# EAGLE design breakout (EAGLE 8.1.1)
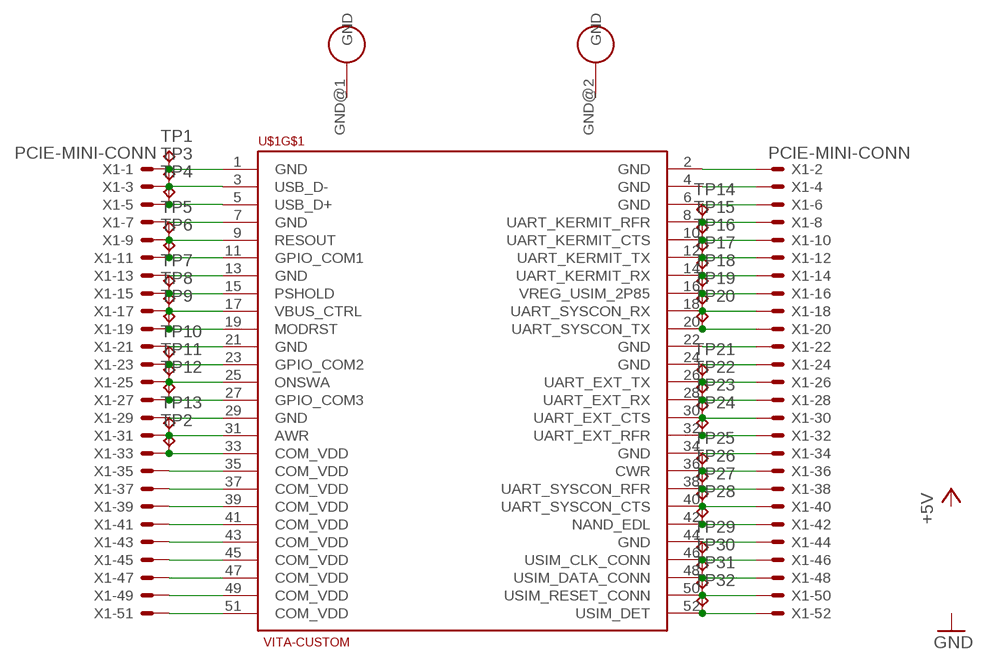
[diagram p0: schematic, sheet 1]

## Parts
TP1  TPTP20R  [TP20R]
TP2  TPTP20R  [TP20R]
TP3  TPTP20R  [TP20R]
TP4  TPTP20R  [TP20R]
TP5  TPTP20R  [TP20R]
TP6  TPTP20R  [TP20R]
TP7  TPTP20R  [TP20R]
TP8  TPTP20R  [TP20R]
TP9  TPTP20R  [TP20R]
TP10  TPTP20R  [TP20R]
TP11  TPTP20R  [TP20R]
TP12  TPTP20R  [TP20R]
TP13  TPTP20R  [TP20R]
TP14  TPTP20R  [TP20R]
TP15  TPTP20R  [TP20R]
TP16  TPTP20R  [TP20R]
TP17  TPTP20R  [TP20R]
TP18  TPTP20R  [TP20R]
TP19  TPTP20R  [TP20R]
TP20  TPTP20R  [TP20R]
TP21  TPTP20R  [TP20R]
TP22  TPTP20R  [TP20R]
TP23  TPTP20R  [TP20R]
TP24  TPTP20R  [TP20R]
TP25  TPTP20R  [TP20R]
TP26  TPTP20R  [TP20R]
TP27  TPTP20R  [TP20R]
TP28  TPTP20R  [TP20R]
TP29  TPTP20R  [TP20R]
TP30  TPTP20R  [TP20R]
TP31  TPTP20R  [TP20R]
TP32  TPTP20R  [TP20R]
U$1  VITA-CUSTOM  [VITA-MINI-PCI-E]
X1  PCIE-MINI-CONN  [PCIE-MINI-CONN]

## Nets
+5V: TP2.TP U$1.33(COM_VDD) U$1.35(COM_VDD) U$1.37(COM_VDD) U$1.39(COM_VDD) U$1.41(COM_VDD) U$1.43(COM_VDD) U$1.45(COM_VDD) U$1.47(COM_VDD) U$1.49(COM_VDD) U$1.51(COM_VDD) X1.33 X1.35 X1.37 X1.39 X1.41 X1.43 X1.45 X1.47 X1.49 X1.51
AWR: TP13.TP U$1.31(AWR) X1.31
CWR: TP25.TP U$1.36(CWR) X1.36
GND: TP1.TP U$1.1(GND) U$1.2(GND) U$1.4(GND) U$1.6(GND) U$1.7(GND) U$1.13(GND) U$1.21(GND) U$1.22(GND) U$1.24(GND) U$1.29(GND) U$1.34(GND) U$1.44(GND) X1.1 X1.2 X1.4 X1.6 X1.7 X1.13 X1.21 X1.22 X1.24 X1.29 X1.34 X1.44
GPIO_COM1: TP6.TP U$1.11(GPIO_COM1) X1.11
GPIO_COM2: TP10.TP U$1.23(GPIO_COM2) X1.23
GPIO_COM3: TP12.TP U$1.27(GPIO_COM3) X1.27
MODRST: TP9.TP U$1.19(MODRST) X1.19
NAND_EDL: TP28.TP U$1.42(NAND_EDL) X1.42
ONSWA: TP11.TP U$1.25(ONSWA) X1.25
PSHOLD: TP7.TP U$1.15(PSHOLD) X1.15
RESOUT: TP5.TP U$1.9(RESOUT) X1.9
UART_EXT_CTS: TP23.TP U$1.30(UART_EXT_CTS) X1.30
UART_EXT_RFR: TP24.TP U$1.32(UART_EXT_RFR) X1.32
UART_EXT_RX: TP22.TP U$1.28(UART_EXT_RX) X1.28
UART_EXT_TX: TP21.TP U$1.26(UART_EXT_TX) X1.26
UART_KERMIT_CTS: TP15.TP U$1.10(UART_KERMIT_CTS) X1.10
UART_KERMIT_RFR: TP14.TP U$1.8(UART_KERMIT_RFR) X1.8
UART_KERMIT_RX: TP17.TP U$1.14(UART_KERMIT_RX) X1.14
UART_KERMIT_TX: TP16.TP U$1.12(UART_KERMIT_TX) X1.12
UART_SYSCON_CTS: TP27.TP U$1.40(UART_SYSCON_CTS) X1.40
UART_SYSCON_RFR: TP26.TP U$1.38(UART_SYSCON_RFR) X1.38
UART_SYSCON_RX: TP19.TP U$1.18(UART_SYSCON_RX) X1.18
UART_SYSCON_TX: TP20.TP U$1.20(UART_SYSCON_TX) X1.20
USB_N: TP3.TP U$1.3(USB_D-) X1.3
USB_P: TP4.TP U$1.5(USB_D+) X1.5
USIM_CLK_CONN: TP29.TP U$1.46(USIM_CLK_CONN) X1.46
USIM_DATA_CONN: TP30.TP U$1.48(USIM_DATA_CONN) X1.48
USIM_DET: TP32.TP U$1.52(USIM_DET) X1.52
USIM_RESET_CONN: TP31.TP U$1.50(USIM_RESET_CONN) X1.50
VBUS_CTRL: TP8.TP U$1.17(VBUS_CTRL) X1.17
VREG_USIM_2P85: TP18.TP U$1.16(VREG_USIM_2P85) X1.16

## Power pins joined to a net without a drawn wire
GND: U$1.GND@1(GND) U$1.GND@2(GND)

## Library data of the parts
TP1-TP32 = testpad:TP: Test pad
U$1 = mini-pci-e:VITA-CUSTOM: Vita specific half Mini PCI Express module.
X1 = con-molex:PCIE-MINI-CONN: MINI PCI EXPRESS CONNECTOR 0.8MM PITCH, 52 CIRCUIT Source: http://www.molex.com/pdm_docs/sd/679105700_sd.pdf

## Board
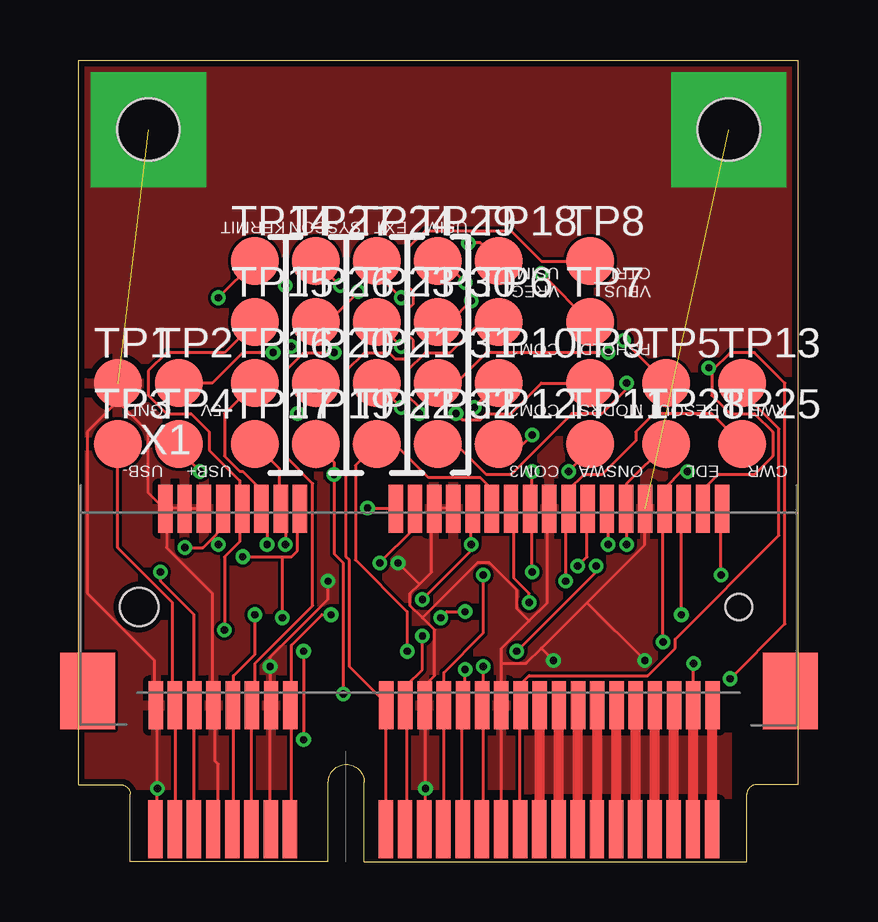
[diagram p1: board, top side]
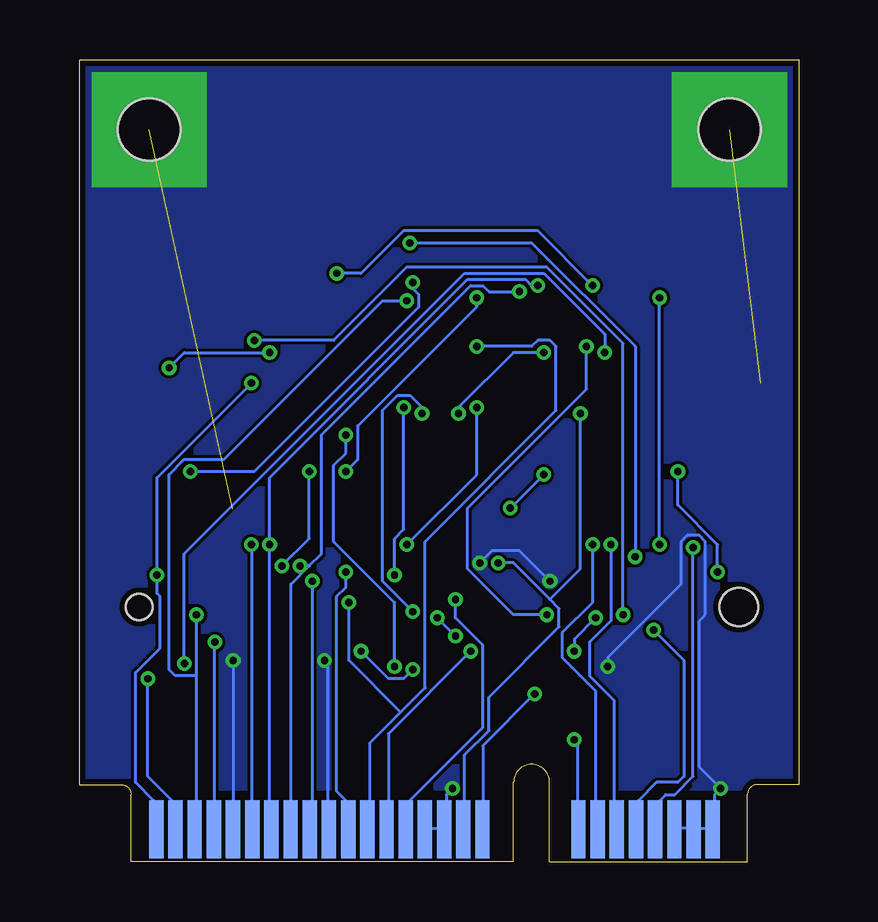
[diagram p2: board, bottom side, seen from below]

Size 30 x 33.4 mm. Coordinates in mm from the lower left corner, seen from the top.
Copper layers (1*16): Top 0.035mm / dielectric 1.5mm / Bottom 0.035mm
Design rules "dirt_cheap_dirty_boards.v1": minimum track width 5mil, minimum drill 12mil, track to track 5mil, track to pad 5mil, pad to pad 5mil, via to via 5mil, smd to smd 0mil, copper to edge 10mil, drill to drill 10mil, minimum pad ring 10mil, minimum via ring 6mil, stop-mask expansion 2mil, vias tented up to drill 25mil, thermal gap 10mil

### Footprints (pad centres in the part's own frame; a part is rotated, then mirrored left to right if it is on the bottom)
TP20R = smd 2 x 2: TP 0,0
VITA-MINI-PCI-E = smd 0.6 x 2.4: 1 -7.95,1.35; 3 -7.15,1.35; 5 -6.35,1.35; 7 -5.55,1.35; 9 -4.75,1.35; 11 -3.95,1.35; 13 -3.15,1.35; 15 -2.35,1.35; 17 1.65,1.35; 19 2.45,1.35; 21 3.25,1.35; 23 4.05,1.35; 25 4.85,1.35; 27 5.65,1.35; 29 6.45,1.35; 31 7.25,1.35; 33 8.05,1.35; 35 8.85,1.35; 37 9.65,1.35; 39 10.45,1.35; 41 11.25,1.35; 43 12.05,1.35; 45 12.85,1.35; 47 13.65,1.35; 49 14.45,1.35; 51 15.25,1.35 | smd 0.6 x 2.4 bottom: 2 -7.55,1.35; 4 -6.75,1.35; 6 -5.95,1.35; 8 -5.15,1.35; 10 -4.35,1.35; 12 -3.55,1.35; 14 -2.75,1.35; 16 -1.95,1.35; 18 2.05,1.35; 20 2.85,1.35; 22 3.65,1.35; 24 4.45,1.35; 26 5.25,1.35; 28 6.05,1.35; 30 6.85,1.35; 32 7.65,1.35; 34 8.45,1.35; 36 9.25,1.35; 38 10.05,1.35; 40 10.85,1.35; 42 11.65,1.35; 44 12.45,1.35; 46 13.25,1.35; 48 14.05,1.35; 50 14.85,1.35; 52 15.65,1.35 | drill 2.6 pad 4.8 square: GND@1 -8.25,30.5; GND@2 15.95,30.5 | hole 2.6: -8.25,30.5; 15.95,30.5
PCIE-MINI-CONN = smd 0.6 x 2: 1 0.7,-4.1; 2 1.1,4.1; 3 1.5,-4.1; 4 1.9,4.1; 5 2.3,-4.1; 6 2.7,4.1; 7 3.1,-4.1; 8 3.5,4.1; 9 3.9,-4.1; 10 4.3,4.1; 11 4.7,-4.1; 12 5.1,4.1; 13 5.5,-4.1; 14 5.9,4.1; 15 6.3,-4.1; 16 6.7,4.1; 17 10.3,-4.1; 18 10.7,4.1; 19 11.1,-4.1; 20 11.5,4.1; 21 11.9,-4.1; 22 12.3,4.1; 23 12.7,-4.1; 24 13.1,4.1; 25 13.5,-4.1; 26 13.9,4.1; 27 14.3,-4.1; 28 14.7,4.1; 29 15.1,-4.1; 30 15.5,4.1; 31 15.9,-4.1; 32 16.3,4.1; 33 16.7,-4.1; 34 17.1,4.1; 35 17.5,-4.1; 36 17.9,4.1; 37 18.3,-4.1; 38 18.7,4.1; 39 19.1,-4.1; 40 19.5,4.1; 41 19.9,-4.1; 42 20.3,4.1; 43 20.7,-4.1; 44 21.1,4.1; 45 21.5,-4.1; 46 21.9,4.1; 47 22.3,-4.1; 48 22.7,4.1; 49 23.1,-4.1; 50 23.5,4.1; 51 23.9,-4.1; 52 24.3,4.1 | smd 2.3 x 3.2: M1 27.15,-3.5; M2 -2.15,-3.5 | hole 1.6: 0,0 | hole 1.1: 25,0

### Placement (x,y rotation side)
TP1  1.62,19.94 0 top
TP2  4.16,19.94 0 top
TP3  1.62,17.4 0 top
TP4  4.16,17.4 0 top
TP5  24.48,19.94 0 top
TP6  17.5,22.48 0 top
TP7  21.31,22.48 0 top
TP8  21.31,25.02 0 top
TP9  21.31,19.94 0 top
TP10  17.5,19.94 0 top
TP11  21.31,17.4 0 top
TP12  17.5,17.4 0 top
TP13  27.66,19.94 0 top
TP14  7.34,25.02 0 top
TP15  7.34,22.48 0 top
TP16  7.34,19.94 0 top
TP17  7.34,17.4 0 top
TP18  17.5,25.02 0 top
TP19  9.88,17.4 0 top
TP20  9.88,19.94 0 top
TP21  12.42,19.94 0 top
TP22  12.42,17.4 0 top
TP23  12.42,22.48 0 top
TP24  12.42,25.02 0 top
TP25  27.66,17.4 0 top
TP26  9.88,22.48 0 top
TP27  9.88,25.02 0 top
TP28  24.48,17.4 0 top
TP29  14.96,25.02 0 top
TP30  14.96,22.48 0 top
TP31  14.96,19.94 0 top
TP32  14.96,17.4 0 top
U$1  11.15,0 0 top
X1  2.51,10.6 0 top

### Tracks (layer width: path | path; a pad name or v marks a point on that pad's centre or on a via)
+5V  (via drill 0.3)
  Top 0.127: X1.39 21.56,6.48 | 21.69,6.48 X1.39 | 22.33,6.48 X1.41 22.45,6.48 | X1.43 23.09,6.48 | 22.58,1.4 U$1.41 22.2,1.4 | 23.09,1.4 U$1.43 23.34,1.4 | 23.85,1.4 U$1.45 24.1,1.4 | 24.99,1.4 U$1.47 24.61,1.4 | 25.5,1.4 U$1.49 25.75,1.4 | 26.26,1.4 U$1.51 | 19.91,6.48 X1.35 20.04,6.48 | 19.41,6.48 X1.33 | 20.17,1.4 U$1.35 19.91,1.52 | 20.67,1.4 U$1.37 20.93,1.4 | 21.44,1.4 U$1.39 21.69,1.4 | 20.8,6.48 X1.37 20.93,6.48 | X1.45 24.1,6.48 | 24.74,6.48 X1.47 24.87,6.48 | TP2.TP 5.56,19.94 6.83,21.21 v8.1,21.21 | v25.63,8.26 25.63,6.6 X1.49 | 25.5,6.48 X1.49 | 26.26,6.48 X1.51 | 25.63,6.48 X1.49 | 19.41,1.52 U$1.33 | 21.44,6.48 X1.39
  Top 0.406: U$1.33 19.21,1.35 X1.33 | U$1.51 26.41,1.35 X1.51 | U$1.35 20.01,1.35 X1.35 | U$1.37 20.81,1.35 X1.37 | U$1.39 21.61,1.35 X1.39 | U$1.41 22.41,1.35 X1.41 | U$1.43 23.21,1.35 X1.43 | U$1.45 24.01,1.35 X1.45 | U$1.47 24.81,1.35 X1.47 | U$1.49 25.61,1.35 X1.49
  Bottom 0.127: v8.1,21.21 8.1,21.97 10.64,24.51 13.94,24.51 25.63,12.83 v25.63,8.26
  pour Top: 18.77,5.71 27.02,5.71 27.02,2.54 18.77,2.54
AWR
  Top 0.127: U$1.31 18.39,1.4 18.39,6.48 X1.31 18.52,6.6 18.52,7.49 18.77,7.75 23.72,7.75 24.87,8.89 24.87,9.27 29.18,13.59 29.18,18.03 27.66,19.56 TP13.TP
CWR  (via drill 0.3)
  Top 0.127: TP25.TP 26.39,18.67 23.98,18.67 23.21,17.91 23.21,17.53 21.82,16.13 21.06,16.13 20.42,15.49 20.42,14.73 X1.36 20.29,14.6 v20.29,11.68
  Bottom 0.127: v20.29,11.68 20.29,1.4 U$1.36
GND  (via drill 0.3)  (2 unrouted)
  Top 0.127: X1.24 15.6,14.73 14.83,14.73 X1.22 14.71,14.6 14.71,12.06 14.2,11.56 | U$1.21 14.45,1.4 v14.45,3.05 14.45,6.48 X1.21 14.45,6.6 14.45,7.37 14.83,7.75 14.83,9.65 14.32,10.16 | 14.2,11.56 13.82,11.18 13.82,10.67 14.32,10.16 | U$1.29 17.63,1.4 17.63,6.48 X1.29 17.63,6.6 17.63,8.26 | 18.77,10.03 17.63,8.89 17.63,8.26 | 18.77,10.03 19.53,10.79 19.53,14.6 X1.34 | 19.28,8.89 18.64,8.26 17.63,8.26 | 19.28,8.89 21.18,10.79 | 21.18,10.79 23.6,13.21 23.6,14.6 X1.44 | 19.28,8.89 v19.79,8.38 | 21.18,10.79 v23.6,8.38 | 14.32,10.16 16.61,12.45 17.12,12.45 18.26,11.3 18.26,10.54 18.77,10.03 | U$1.13 7.97,1.4 7.97,6.48 X1.13 7.97,6.6 v7.97,8.13 7.97,8.51 10.39,10.92 v10.39,11.68 | U$1.7 5.69,1.4 5.82,1.52 5.82,4.06 5.69,4.19 5.69,6.48 X1.7 5.56,6.6 5.56,11.18 3.66,13.08 3.66,14.6 X1.2 | U$1.1 3.28,1.4 v3.28,3.05 3.28,6.48 X1.1 3.15,6.6 3.15,8.38 0.35,11.18 0.35,17.91 1.62,19.18 | X1.2 3.66,14.73 4.29,14.73 X1.4 4.42,14.73 5.18,14.73 X1.6 | 1.62,19.18 2.89,17.91 2.89,15.37 3.53,14.73 X1.2 | 1.62,19.18 TP1.TP | v13.31,12.45 14.2,11.56
  Bottom 0.127: U$1.6 5.18,1.4 4.42,1.4 U$1.4 4.29,1.4 3.66,1.4 U$1.2 3.53,1.4 3.53,2.79 v3.28,3.05 4.16,3.94 4.16,10.03 3.91,10.29 3.91,13.33 4.16,13.59 4.67,13.59 4.93,13.33 4.93,11.56 7.97,8.51 v7.97,8.13 | U$1.24 15.6,1.4 14.83,1.4 U$1.22 14.71,1.4 14.71,2.79 v14.45,3.05 | v19.79,8.38 19.66,8.26 19.66,1.4 U$1.34 | v23.6,8.38 23.6,1.4 U$1.44 | v13.31,12.45 12.8,12.95 11.66,12.95 v10.39,11.68
  pour Top (rank 2): -0.28,33.66 30.2,33.66 30.2,3.18 -0.28,3.18
  pour Bottom: -0.28,33.66 30.2,33.66 30.2,3.18 -0.28,3.18
GPIO_COM1  (via drill 0.3)
  Top 0.127: U$1.11 7.21,1.4 7.21,6.48 X1.11 7.34,6.6 7.34,8.26 9.75,10.67 9.75,15.75 8.61,16.89 8.61,20.45 9.37,21.21 v10.64,21.21 | TP6.TP 16.74,22.48 15.47,21.21 14.45,21.21 13.69,20.45 13.69,19.43 14.2,18.92 v14.2,18.67
  Bottom 0.127: v14.2,18.67 14.2,18.92 11.91,21.21 v10.64,21.21
GPIO_COM2  (via drill 0.3)
  Top 0.127: U$1.23 15.21,1.4 X1.23 15.21,7.87 16.87,9.53 v16.87,11.94 | v16.48,18.92 TP10.TP
  Bottom 0.127: v16.48,18.92 16.48,13.84 16.87,13.46 v16.87,11.94
GPIO_COM3  (via drill 0.3)
  Top 0.127: U$1.27 16.87,1.4 16.87,6.48 X1.27 16.87,6.6 v16.87,8.13 | TP12.TP 18.52,17.4 v18.9,17.78
  Bottom 0.127: v18.9,17.78 18.9,17.02 19.41,16.51 19.41,13.33 16.87,10.79 v16.87,8.13
MODRST  (via drill 0.3)
  Top 0.127: U$1.19 13.69,1.4 13.69,6.48 X1.19 13.69,6.6 13.69,7.37 14.32,8 v14.32,9.4 | TP9.TP 19.28,19.94 18.01,18.67 16.99,18.67 16.74,18.41 15.98,18.41 v15.72,18.67 | v16.1,10.41 15.34,10.41 v15.09,10.16
  Bottom 0.127: v15.72,18.67 15.72,18.92 16.23,19.43 16.74,19.43 17.37,18.8 17.37,11.68 v16.1,10.41 | v14.32,9.4 v15.09,10.16
NAND_EDL  (via drill 0.3)
  Top 0.127: TP28.TP 22.83,15.75 22.83,14.73 X1.42 22.83,14.6 v22.83,13.21
  Bottom 0.127: v22.83,13.21 22.83,1.4 U$1.42
ONSWA  (via drill 0.3)
  Top 0.127: U$1.25 15.98,1.4 15.98,6.48 X1.25 16.1,6.6 v16.1,8 | TP11.TP 21.31,17.15 v20.42,16.26 | v21.56,12.32 21.56,12.06 v18.26,8.76
  Bottom 0.127: v20.42,16.26 20.42,13.46 v21.56,12.32 | v18.26,8.76 17.12,7.62 16.48,7.62 v16.1,8
PSHOLD  (via drill 0.3)
  Top 0.127: U$1.15 8.86,1.4 8.86,6.48 X1.15 8.86,6.6 8.86,9.02 10.13,10.29 v10.51,10.29 | v19.28,24.51 TP7.TP | v8.61,24 8.61,21.72 v8.86,21.46
  Bottom 0.127: v19.28,24.51 18.26,24.51 16.48,26.29 10.9,26.29 v8.61,24 | v8.86,21.46 8.86,19.69 13.82,14.73 13.82,12.19 11.91,10.29 v10.51,10.29
RESOUT  (via drill 0.3)
  Top 0.127: U$1.9 6.45,1.4 6.45,6.48 X1.9 6.45,6.6 6.45,7.75 7.34,8.64 v7.34,10.29 | v22.71,21.72 TP5.TP
  Bottom 0.127: v22.71,21.72 19.41,21.72 16.36,24.77 10.51,24.77 7.34,21.59 v7.34,10.29
UART_EXT_CTS  (via drill 0.3)
  Top 0.127: v13.44,21.46 TP23.TP | v18.77,10.79 18.77,11.18 18.13,11.81 18.13,14.6 X1.30
  Bottom 0.127: v13.44,21.46 11.15,21.46 10.9,21.72 10.39,21.72 10.13,21.46 10.13,18.8 15.6,13.33 15.6,7.24 16.61,6.22 | 16.61,6.22 17.88,4.95 17.88,1.4 U$1.30 | v18.77,10.79 18.77,8.38 16.61,6.22
UART_EXT_RFR  (via drill 0.3)
  Top 0.127: v18.9,12.06 18.9,14.6 X1.32 18.9,14.73 v18.9,16.26 | TP24.TP 12.42,24.51 v13.44,23.49
  Bottom 0.127: v18.9,12.06 18.9,11.43 19.28,11.05 19.28,2.92 18.9,2.54 18.9,1.4 U$1.32 | v13.44,23.49 13.44,23.11 18.39,18.16 18.39,16.76 v18.9,16.26
UART_EXT_RX  (via drill 0.3)
  Top 0.127: X1.28 17.12,14.73 17.12,15.62 16.74,16 14.58,16 13.18,17.4 TP22.TP 11.53,16.51 11.53,12.57 13.69,10.41 v13.69,8.76
  Bottom 0.127: v13.69,8.76 17.12,5.33 17.12,1.4 U$1.28
UART_EXT_TX  (via drill 0.3)
  Top 0.127: v14.32,10.92 16.36,12.95 v16.36,13.21 16.36,14.6 X1.26 | v13.44,18.92 TP21.TP
  Bottom 0.127: v14.32,10.92 14.32,10.16 13.18,9.02 13.18,5.59 16.36,2.41 16.36,1.4 U$1.26 | v13.44,18.92 13.44,16.13 v16.36,13.21
UART_KERMIT_CTS  (via drill 0.3)
  Top 0.127: TP15.TP 6.07,21.21 3.66,21.21 2.89,20.45 2.89,19.43 3.66,18.67 4.67,18.67 5.43,17.91 5.43,17.15 6.71,15.87 6.71,14.73 X1.10 6.71,14.6 6.71,13.33 6.07,12.7 v6.07,9.65
  Bottom 0.127: v6.07,9.65 4.8,8.38 4.8,3.56 5.05,3.3 5.94,3.3 6.71,2.54 6.71,1.4 U$1.10
UART_KERMIT_RFR  (via drill 0.3)
  Top 0.127: 5.56,13.46 5.18,13.08 v4.42,13.08 | 5.56,13.46 5.94,13.84 5.94,14.6 X1.8 | v5.82,23.49 TP14.TP | 5.56,13.46 v5.82,13.21
  Bottom 0.127: v4.42,13.08 4.42,3.56 5.18,2.79 5.56,2.79 5.94,2.41 5.94,1.4 U$1.8 | v5.82,13.21 v5.82,23.49
UART_KERMIT_RX  (via drill 0.3)
  Top 0.127: TP17.TP 8.36,16.38 8.36,14.73 X1.14 8.48,14.6 8.61,14.48 v8.61,13.21
  Bottom 0.127: v8.61,13.21 8.61,10.79 9.88,9.53 9.88,8.51 8.48,7.11 8.48,1.4 U$1.14
UART_KERMIT_TX  (via drill 0.3)
  Top 0.127: TP16.TP 6.07,18.67 6.07,16.89 6.71,16.26 6.83,16.26 7.59,15.49 7.59,14.73 X1.12 7.72,14.6 7.85,14.48 v7.85,13.21
  Bottom 0.127: v7.85,13.21 7.85,10.03 8.74,9.14 8.74,7.75 7.72,6.73 7.72,1.4 U$1.12
UART_SYSCON_CTS  (via drill 0.3)
  Top 0.127: v10.9,24 TP27.TP | v22.07,13.21 22.07,14.6 X1.40
  Bottom 0.127: v10.9,24 11.15,24 11.4,24.26 13.82,24.26 22.07,16 v22.07,13.21 22.07,1.4 U$1.40
UART_SYSCON_RFR  (via drill 0.3)
  Top 0.127: TP26.TP 10.39,22.48 v11.66,23.75 | v20.8,12.32 21.18,12.7 21.18,14.6 X1.38
  Bottom 0.127: v11.66,23.75 12.93,23.75 13.18,24 13.69,24 19.91,17.78 19.91,12.83 20.42,12.32 | 20.42,12.32 21.18,11.56 21.18,1.4 U$1.38 | 20.42,12.32 v20.8,12.32
UART_SYSCON_RX  (via drill 0.3)
  Top 0.127: v12.04,14.73 13.18,14.73 X1.18 | TP19.TP 10.64,16.64 v10.64,16.13 10.64,12.83 11.02,12.45 v11.02,6.98
  Bottom 0.127: v10.64,16.13 v12.04,14.73 | v11.02,6.98 13.18,4.83 13.18,1.4 U$1.18
UART_SYSCON_TX  (via drill 0.3)
  Top 0.127: v12.55,12.45 13.94,13.84 13.94,14.6 X1.20 | TP20.TP 9.88,19.43 v9.12,18.67
  Bottom 0.127: v12.55,12.45 11.91,12.45 10.39,10.92 | 10.39,10.92 10.01,10.54 10.01,9.78 12.93,6.86 12.93,5.46 13.94,4.45 13.94,1.4 U$1.20 | v9.12,18.67 9.12,12.19 10.39,10.92
USB_N
  Top 0.127: U$1.3 4.04,1.4 4.04,6.48 X1.3 3.91,6.6 3.91,10.79 1.62,13.08 TP3.TP
USB_P  (via drill 0.3)
  Top 0.127: U$1.5 4.8,6.48 X1.5 4.8,6.6 4.8,10.29 3.4,11.68 v3.4,12.06 | TP4.TP 4.16,17.15 v5.05,16.26
  Bottom 0.127: v5.05,16.26 5.05,14.86 3.4,13.21 v3.4,12.06
USIM_CLK_CONN  (via drill 0.3)
  Top 0.127: v24.36,9.14 24.36,14.6 X1.46 24.48,14.73 24.48,15.62 25.12,16.26 v25.37,16.26 | TP29.TP 15.21,25.02 v16.1,24.13
  Bottom 0.127: v24.36,9.14 24.36,1.4 U$1.46 | v16.1,24.13 16.1,23.88 15.85,23.62 15.85,23.11 22.71,16.26 v25.37,16.26
USIM_DATA_CONN  (via drill 0.3)
  Top 0.127: v25.12,10.29 25.12,14.6 X1.48 | TP30.TP 15.47,22.48 v16.36,23.37
  Bottom 0.127: 25.12,7.75 25.12,1.4 U$1.48 | 25.12,7.75 v25.12,10.29 | v16.36,23.37 17.37,23.37 23.98,16.76 25.63,16.76 26.26,16.13 26.26,8 26.01,7.75 25.12,7.75
USIM_DET  (via drill 0.3)
  Top 0.127: v26.77,11.94 26.77,14.6 X1.52 | TP32.TP 15.72,17.4 16.99,16.13 18.01,16.13 20.55,18.67 21.82,18.67 22.83,19.69 v22.83,19.94
  Bottom 0.127: U$1.52 26.9,1.4 26.9,2.54 27.66,3.3 27.66,7.87 26.64,8.89 26.64,11.05 26.77,11.18 v26.77,11.94 26.77,16 v22.83,19.94
USIM_RESET_CONN  (via drill 0.3)
  Top 0.127: 26.39,20.45 26.39,19.43 27.15,18.67 28.17,18.67 28.93,17.91 28.93,16.89 28.17,16.13 26.64,16.13 26.14,15.62 26.14,14.73 X1.50 | 26.39,20.45 27.15,21.21 28.17,21.21 29.44,19.94 29.44,9.91 v27.15,7.62 | TP31.TP 15.72,19.94 16.99,21.21 v22.07,21.21 | 26.39,20.45 v26.26,20.57
  Bottom 0.127: v27.15,7.62 27.15,3.56 26.01,2.41 26.01,1.4 U$1.50 | v22.07,21.21 25.63,21.21 v26.26,20.57
VBUS_CTRL
  Top 0.127: U$1.17 12.8,1.4 12.8,6.48 X1.17 12.8,6.6 11.28,8.13 11.28,12.57 11.15,12.7 11.15,20.45 11.91,21.21 12.93,21.21 13.18,20.95 13.69,20.95 13.94,21.21 13.94,21.72 13.69,21.97 13.69,22.99 13.94,23.24 13.94,23.75 13.69,24 13.69,25.53 14.45,26.29 18.01,26.29 19.28,25.02 TP8.TP
VREG_USIM_2P85  (via drill 0.3)
  Top 0.127: v6.83,12.7 8.48,12.7 | 8.48,12.7 8.86,12.7 9.12,12.95 9.12,14.6 X1.16 | v16.23,25.78 16.74,25.78 TP18.TP | v9.37,8.76 v9.37,5.08 | 8.48,12.7 v8.48,10.16
  Bottom 0.127: v6.83,12.7 6.83,21.46 11.15,25.78 v16.23,25.78 | v9.37,5.08 9.24,4.95 9.24,1.4 U$1.16 | v9.37,8.76 9.37,9.27 v8.48,10.16

### Text on the board
tPlace: KERMIT | SYSCON | EXT | USIM | VREG_ / USIM | VBUS_ / CTRL | COM1 | PSHOLD | GND | +5V | COM2 | MODRST | RESOUT | AWR | USB- | USB+ | COM3 | ONSWA | EDL | CWR